# Altium project GPIOmodule.PrjPCB
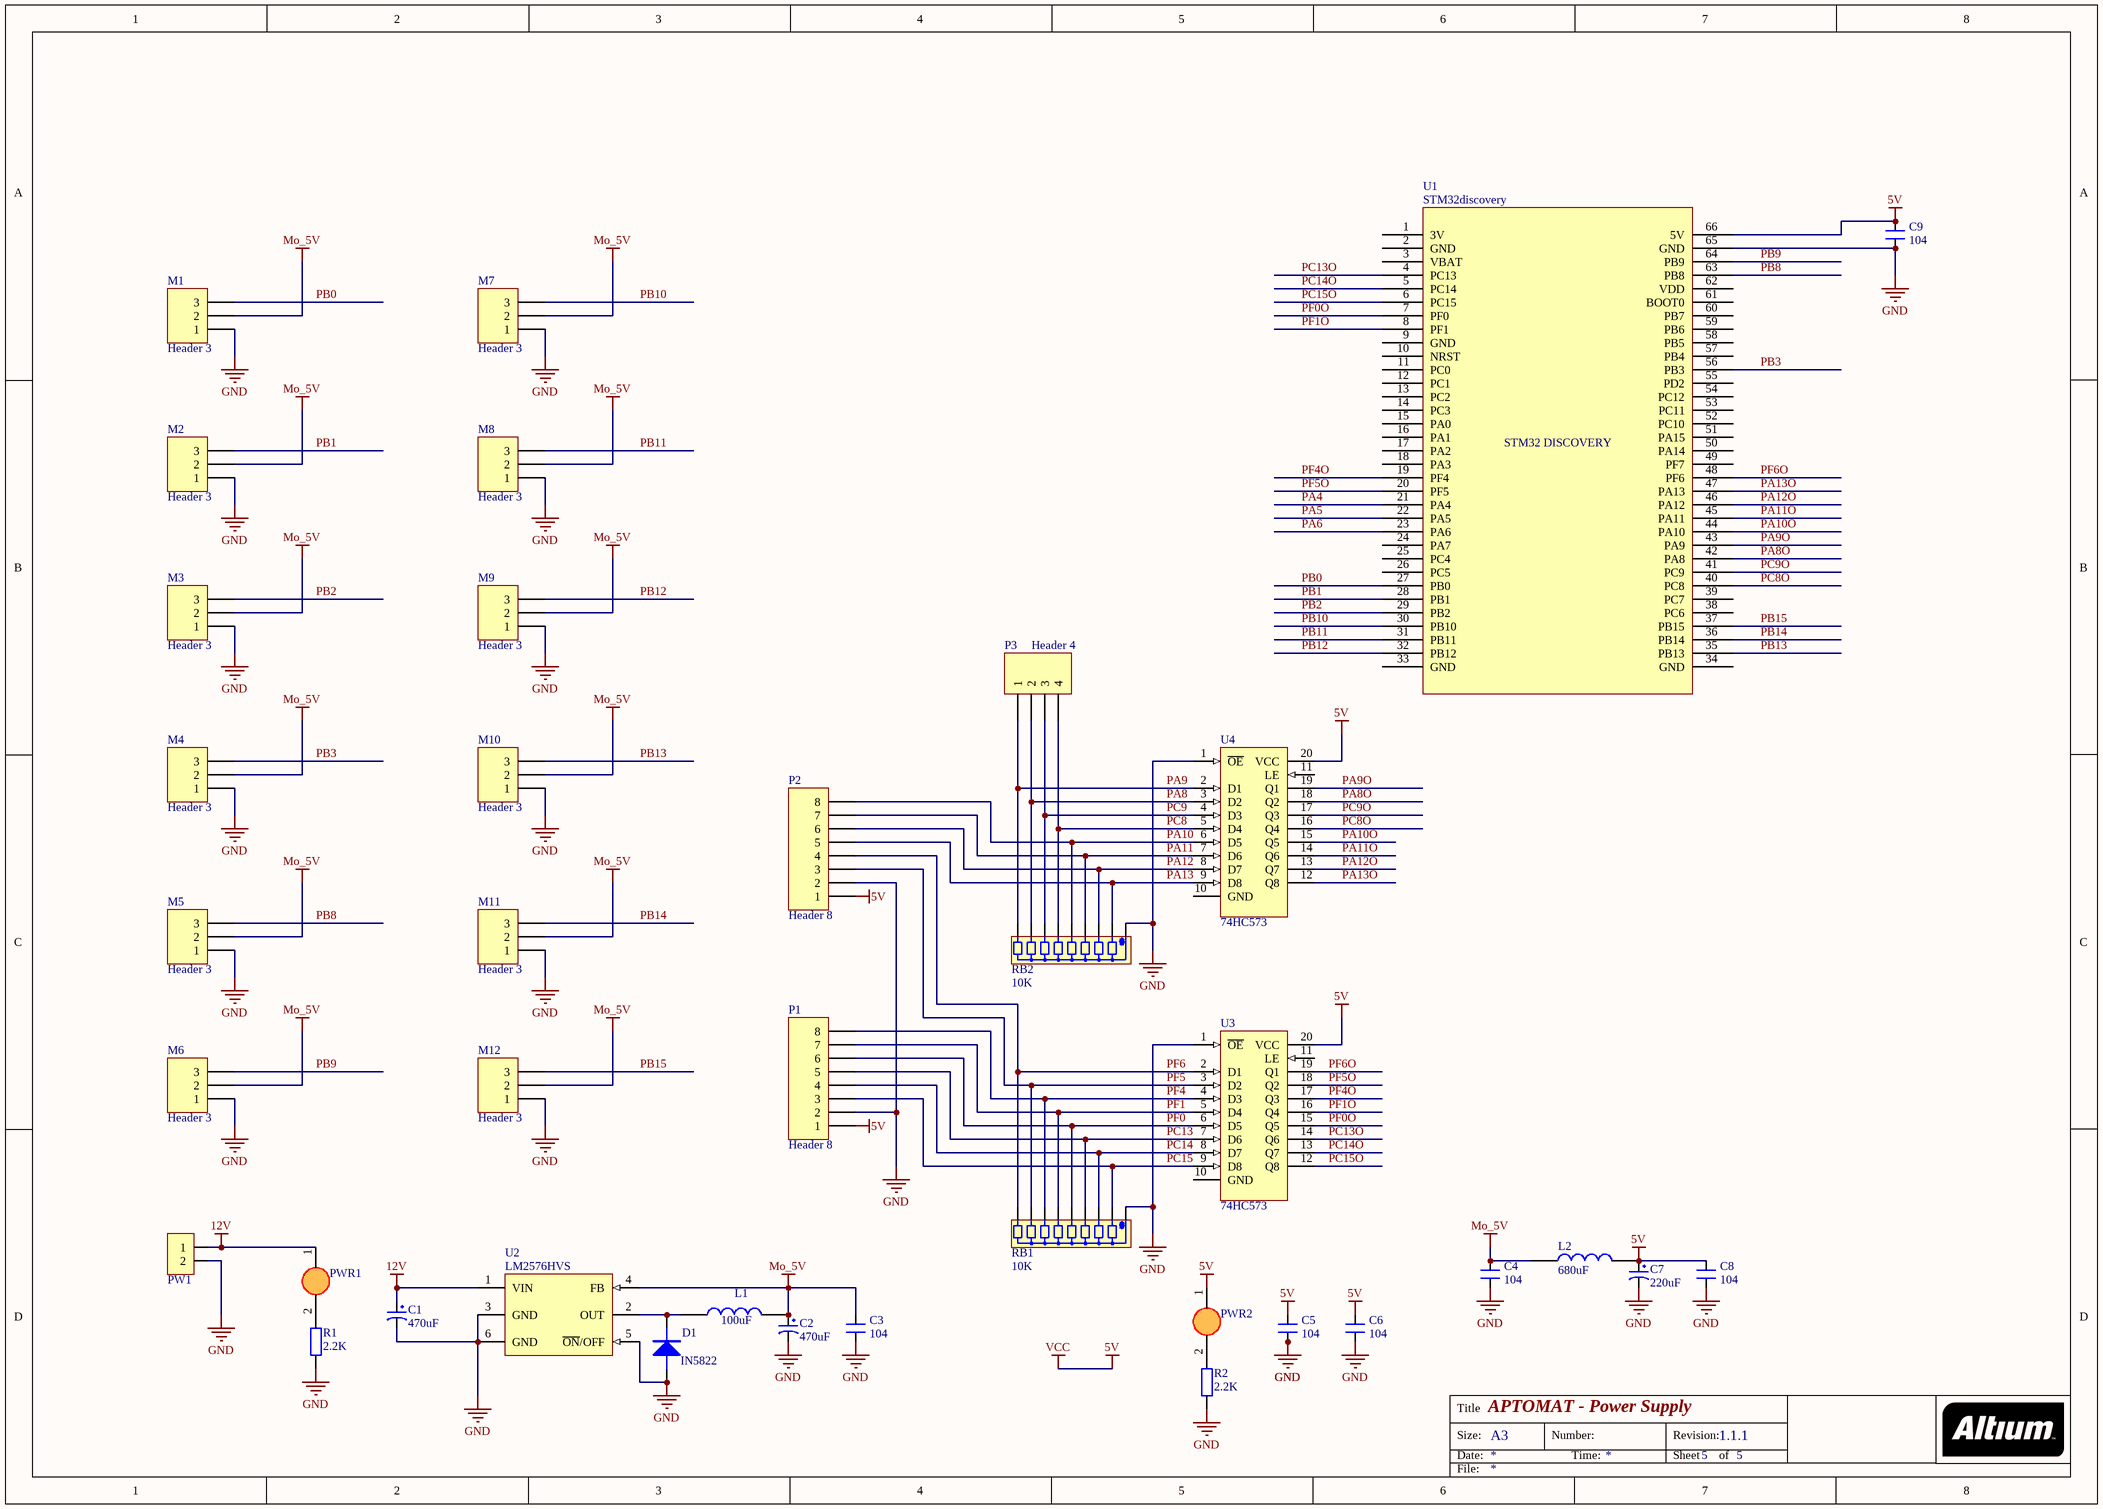
[diagram p0: GPIO.SchDoc]
1 sheet, 38 parts. Net scope: global (net labels, ports and power ports of the same name join across sheets).
Board file: GPIOmodule.PcbDoc

## Sheet GPIO.SchDoc: APTOMAT - Power Supply
size A3; Revision: 1.1.1; SheetNumber: 5; SheetTotal: 5; DrawnBy: KJP; ProjectNumber: 4397; PCBRevision: 0071KJP; DocumentSize: A4; PCAName: PCA10040; PCBNumber: 400150; ProjectName: Quark

### Parts
C1  470uF  [TU_NHOM_470uF_25V_MH]
C2  470uF  [TU_NHOM_470uF_25V_MH]
C3  104  [0805_HV]
C4  104  [0805_HV]
C5  104  [0805_HV]
C6  104  [0805_HV]
C7  220uF  [TU_NHOM_2.5_MH]
C8  104  [0805_HV]
C9  104  [0805_HV]
D1  IN5822  [SOD123]
L1  100uF  [IND_2118-V-RC]
L2  680uF  [Inductor 4.5x5]
M1  Header 3  [HDR1X3]
M2  Header 3  [HDR1X3]
M3  Header 3  [HDR1X3]
M4  Header 3  [HDR1X3]
M5  Header 3  [HDR1X3]
M6  Header 3  [HDR1X3]
M7  Header 3  [HDR1X3]
M8  Header 3  [HDR1X3]
M9  Header 3  [HDR1X3]
M10  Header 3  [HDR1X3]
M11  Header 3  [HDR1X3]
M12  Header 3  [HDR1X3]
P1  Header 8  [HEADER2M_8P]
P2  Header 8  [HEADER2M_8P]
P3  Header 4  [HDR1X4]
PW1  CON 2 EDG 5.08_MH  [CON 2 EDG 5.08]  (value not drawn)
PWR1  LED3  [LED_0805]  (value not drawn)
PWR2  LED3  [LED_0805]  (value not drawn)
R1  2.2K  [Tro SMD 0805]
R2  2.2K  [Tro SMD 0805]
RB1  TRO_BANG_A09_MH  [TRO_BANG_A09]  (value not drawn)
RB2  TRO_BANG_A09_MH  [TRO_BANG_A09]  (value not drawn)
U1  STM32discovery  [STM32discovery_kit]
U2  LM2576HVS  [TO263-5]
U3  74HC573  [DIP20]
U4  74HC573  [DIP20]

### Nets
5V: C5.2 C6.2 C7.1 C8.2 C9.2 L2.2 P1.1 P2.1 PWR2.1(A) U1.66(5V) U3.20(VCC) U4.20(VCC)  [also labelled VCC]
12V: C1.1 PW1.1 PWR1.1(A) U2.1(VIN)
GND: C1.2 C2.2 C3.1 C4.1 C5.1 C6.1 C7.2 C8.1 C9.1 D1.1 M1.1 M2.1 M3.1 M4.1 M5.1 M6.1 M7.1 M8.1 M9.1 M10.1 M11.1 M12.1 P1.2 P2.2 PW1.2 R1.1 R2.1 RB1.1 RB2.1 U1.65(GND) U2.3(GND) U2.5(~{ON}/OFF) U2.6(GND) U3.1(~{OE}) U4.1(~{OE})
Mo_5V: C2.1 C3.2 C4.2 L1.2 L2.1 M1.2 M2.2 M3.2 M4.2 M5.2 M6.2 M7.2 M8.2 M9.2 M10.2 M11.2 M12.2 U2.4(FB)
PA4: U1.21(PA4)
PA5: U1.22(PA5)
PA6: U1.23(PA6)
PA8: P3.2 RB2.8 U4.3(D2)
PA8O: U1.42(PA8) U4.18(Q2)
PA9: P3.1 RB2.9 U4.2(D1)
PA9O: U1.43(PA9) U4.19(Q1)
PA10: P2.8 RB2.5 U4.6(D5)
PA10O: U1.44(PA10) U4.15(Q5)
PA11: P2.7 RB2.4 U4.7(D6)
PA11O: U1.45(PA11) U4.14(Q6)
PA12: P2.6 RB2.3 U4.8(D7)
PA12O: U1.46(PA12) U4.13(Q7)
PA13: P2.5 RB2.2 U4.9(D8)
PA13O: U1.47(PA13) U4.12(Q8)
PB0: M1.3 U1.27(PB0)
PB1: M2.3 U1.28(PB1)
PB2: M3.3 U1.29(PB2)
PB3: M4.3 U1.56(PB3)
PB8: M5.3 U1.63(PB8)
PB9: M6.3 U1.64(PB9)
PB10: M7.3 U1.30(PB10)
PB11: M8.3 U1.31(PB11)
PB12: M9.3 U1.32(PB12)
PB13: M10.3 U1.35(PB13)
PB14: M11.3 U1.36(PB14)
PB15: M12.3 U1.37(PB15)
PC8: P3.4 RB2.6 U4.5(D4)
PC8O: U1.40(PC8) U4.16(Q4)
PC9: P3.3 RB2.7 U4.4(D3)
PC9O: U1.41(PC9) U4.17(Q3)
PC13: P1.5 RB1.4 U3.7(D6)
PC13O: U1.4(PC13) U3.14(Q6)
PC14: P1.4 RB1.3 U3.8(D7)
PC14O: U1.5(PC14) U3.13(Q7)
PC15: P1.3 RB1.2 U3.9(D8)
PC15O: U1.6(PC15) U3.12(Q8)
PF0: P1.6 RB1.5 U3.6(D5)
PF0O: U1.7(PF0) U3.15(Q5)
PF1: P1.7 RB1.6 U3.5(D4)
PF1O: U1.8(PF1) U3.16(Q4)
PF4: P1.8 RB1.7 U3.4(D3)
PF4O: U1.19(PF4) U3.17(Q3)
PF5: P2.3 RB1.8 U3.3(D2)
PF5O: U1.20(PF5) U3.18(Q2)
PF6: P2.4 RB1.9 U3.2(D1)
PF6O: U1.48(PF6) U3.19(Q1)
NetD1_2: D1.2 L1.1 U2.2(OUT)
NetPWR1_2: PWR1.2(K) R1.2
NetPWR2_2: PWR2.2(K) R2.2

Not connected (* = marked no-connect by the designer): U1 1(3V) 2(GND) 3(VBAT) 9(GND) 10(NRST) 11(PC0) 12(PC1) 13(PC2) 14(PC3) 15(PA0) 16(PA1) 17(PA2) 18(PA3) 24(PA7) 25(PC4) 26(PC5) 33(GND) 34(GND) 38(PC6) 39(PC7) 49(PF7) 50(PA14) 51(PA15) 52(PC10) 53(PC11) 54(PC12) 55(PD2) 57(PB4) 58(PB5) 59(PB6) 60(PB7) 61(BOOT0) 62(VDD); U3 10(GND) 11(LE); U4 10(GND) 11(LE)

### Notes on the sheet
- Title
- Size:
- Date:
- A3
- Number:
- Time:
- Revision:
- Sheet
- of
- File:
- (in symbol STM32Discovery_kit) STM32 DISCOVERY
- (in symbol TRO_BANG_A09_MH) 10K

### Library data of the parts
C1 C2 = TU_NHOM_470uF_25V_MH: Value: 47uF/16 - 50V; Description 1: 470uF/6,3V - 330uF/10V - 220uF/16V; Description 2: 100uF/25V - 35V - 47uF/50V - 22uF/100V; Description 3: 33uF => 47uF/63V - 1uF => 4,7uF/160V; Description 4: 1uF => 2,2uF/250V - 1uF/350V
C3-C6 C8 C9 = CM: Cap SMD; Value: 103
C7 = TU_NHOM_220uF_25V_MH: LINK: https://item.taobao.com/item.htm?spm=a230r.1.14.282.6c612953FsebRk&id=546158429968&ns=1&abbucket=10#detail
D1 = Diode S4 SOD123 ( 1N5819 SOD123)_MH: Diode S4 SOD123 ( 1N5819 SOD123)
L1 = Inductor Lm2576_MH: cuon cam
L2 = Inductor 4.5x5_MH
M1-M12 = Header 3: Header, 3-Pin; LatestRevisionDate: 17-Jul-2002; LatestRevisionNote: Re-released for DXP Platform.; Publisher: Altium Limited
P1 P2 = Header 8: Header, 8-Pin; LatestRevisionDate: 17-Jul-2002; LatestRevisionNote: Re-released for DXP Platform.; Publisher: Altium Limited
P3 = Header 4: Header, 4-Pin; LatestRevisionDate: 17-Jul-2002; LatestRevisionNote: Re-released for DXP Platform.; Publisher: Altium Limited
PW1 = CON 2 EDG 5.08_MH: CON 2 EDG 5.08 (xanh cong)
PWR1 PWR2 = LED SMD_0805_MH: LED 3mm
R1 R2 = TRO_SMD_0805_MH
U1 = STM32Discovery_kit
U2 = LM2576HVS-5.0V BUCK 5V 3A TO263-5 _MH: PartNumber: LM2576T-5.0; Manufacturer: National Semiconductor; CompType: Switcher; PackageTopMarking: NSUZXYTT*LM2576T*-5.0 P+; PowerWise: N; FirstPublished: 4-Dec-2008; DatasheetVersion: Aug-2004; PackageVersion: revJ, Jan-1992; PackageReference: T05A; Publisher: Altium Limited; PackageDescription: TO-220, Molded, 5 Lead, Straight; RoHS: O; PinCount: 5; DigiKeyPartNumber: LM2576T-5.0-ND; Code_JEDEC: TO-220-AB; ComponentLink1Description: LM2576 Datasheet; ComponentLink1URL: http://www.national.com/ds/LM/LM2576.pdf; ComponentLink2Description: LM2576 Web Page; ComponentLink2URL: http://www.national.com/pf/LM/LM2576.html; ComponentLink3Description: T05A Package Page; ComponentLink3URL: http://www.national.com/packaging/folders/t05a.html
U3 U4 = 74HC573 DIP20 IC Flip-Flop_MH: Octal D-Type Latch with 3-State Output Non-Inverting; Value: 74HC573; Copyright by: VanDungEvn@Gmail.com